# Altium schematic sheet SOM Display, HDMI, EDP.SchDoc
size 381 x 241 mm; SheetNumber: 8; SheetTotal: 8
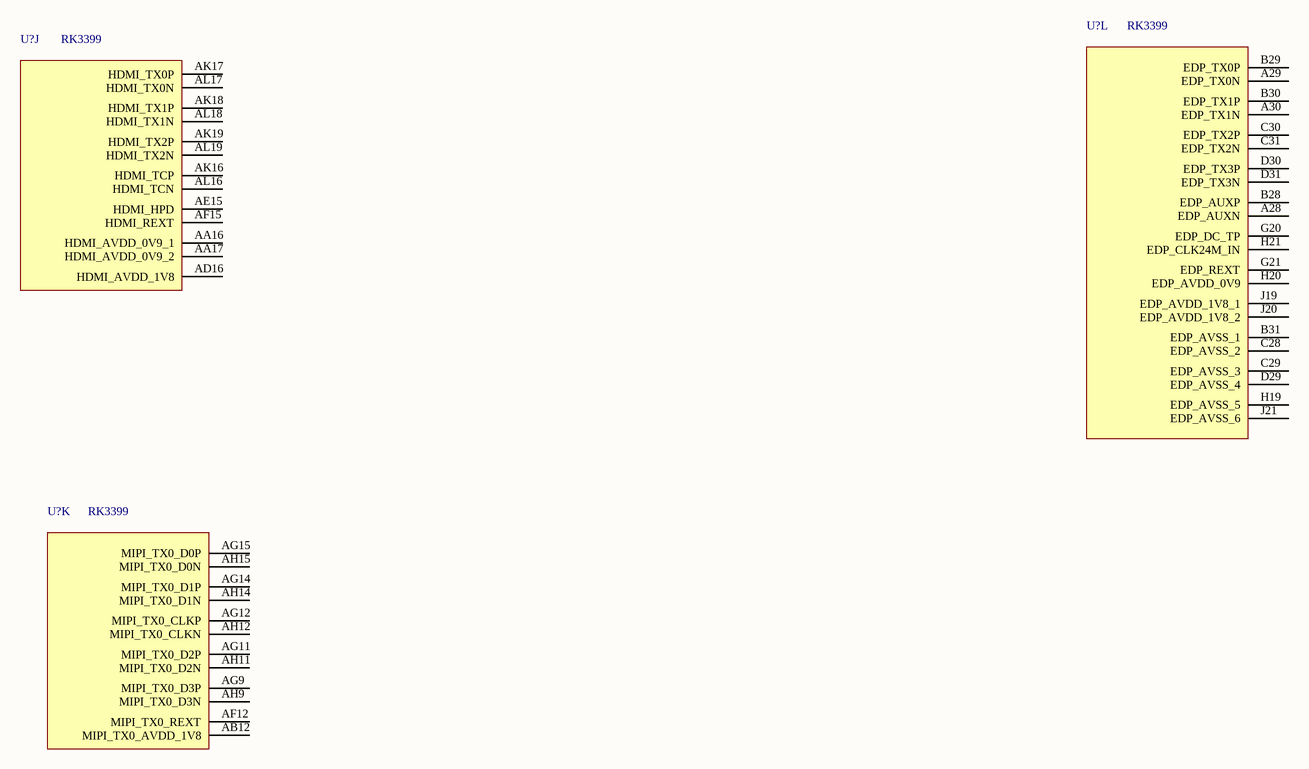
[diagram p0: SOM Display, HDMI, EDP.SchDoc]

## Parts
(Parts that share a designator on the sheet are numbered #1, #2 ... from top to bottom, then left to right.)
U?#1  RK3399  [FBGA828_23_826X826]  (part L of 24)
U?#2  RK3399  [FBGA828_23_826X826]  (part J of 24)
U?#3  RK3399  [FBGA828_23_826X826]  (part K of 24)

## Nets

Not connected (* = marked no-connect by the designer): U?#1 A28(EDP_AUXN) A29(EDP_TX0N) A30(EDP_TX1N) B28(EDP_AUXP) B29(EDP_TX0P) B30(EDP_TX1P) B31(EDP_AVSS_1) C28(EDP_AVSS_2) C29(EDP_AVSS_3) C30(EDP_TX2P) C31(EDP_TX2N) D29(EDP_AVSS_4) D30(EDP_TX3P) D31(EDP_TX3N) G20(EDP_DC_TP) G21(EDP_REXT) H19(EDP_AVSS_5) H20(EDP_AVDD_0V9) H21(EDP_CLK24M_IN) J19(EDP_AVDD_1V8_1) J20(EDP_AVDD_1V8_2) J21(EDP_AVSS_6); U?#2 AA16(HDMI_AVDD_0V9_1) AA17(HDMI_AVDD_0V9_2) AD16(HDMI_AVDD_1V8) AE15(HDMI_HPD) AF15(HDMI_REXT) AK16(HDMI_TCP) AK17(HDMI_TX0P) AK18(HDMI_TX1P) AK19(HDMI_TX2P) AL16(HDMI_TCN) AL17(HDMI_TX0N) AL18(HDMI_TX1N) AL19(HDMI_TX2N); U?#3 AB12(MIPI_TX0_AVDD_1V8) AF12(MIPI_TX0_REXT) AG9(MIPI_TX0_D3P) AG11(MIPI_TX0_D2P) AG12(MIPI_TX0_CLKP) AG14(MIPI_TX0_D1P) AG15(MIPI_TX0_D0P) AH9(MIPI_TX0_D3N) AH11(MIPI_TX0_D2N) AH12(MIPI_TX0_CLKN) AH14(MIPI_TX0_D1N) AH15(MIPI_TX0_D0N)

## Library data of the parts
U?#1-U?#3 = IC_RK3399-FCBGA828: RK3399 is a low power, high performance processor for computing, personal mobile.; Manufacturer: Rockchip; Manufacturer Part Number: RK3399; Case/Package: FCBGA828; Supplier-1: Rockchip